# Altium schematic sheet Solenoids.SchDoc: Solenoids & Pressure Transducers
size Legal; DocumentNumber: 8; SheetNumber: 8; SheetTotal: 8; Project: Olympus
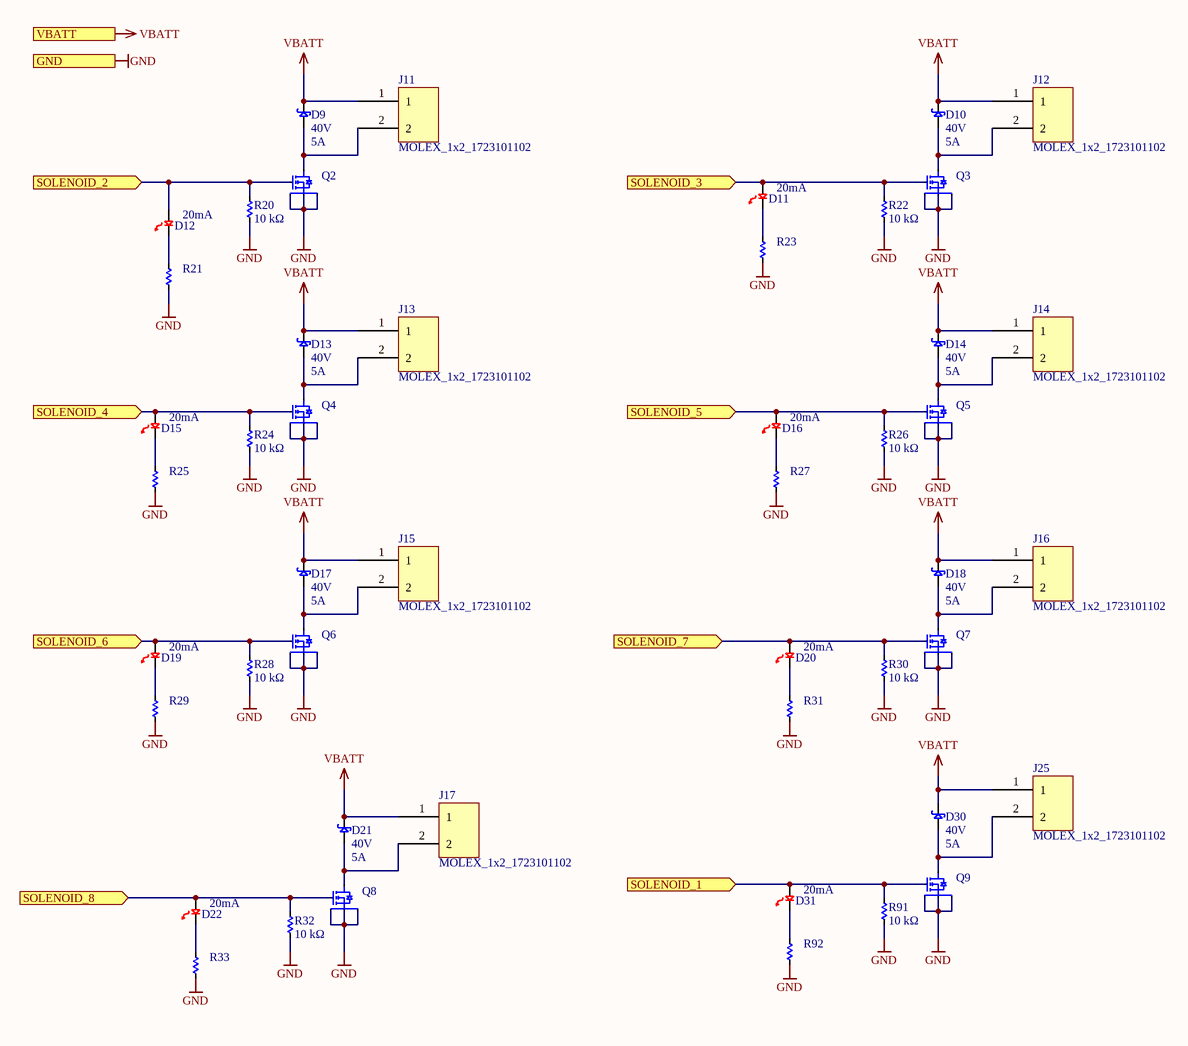
[diagram p0: Solenoids.SchDoc]

## Parts
D9  Voltage - DC Reverse (Vr) (Max): 40V  Current - Average Rectified (Io): 5A  [SMC]  (hidden comment: SCHOTTKY_B540C-13-F)
D10  Voltage - DC Reverse (Vr) (Max): 40V  Current - Average Rectified (Io): 5A  [SMC]  (hidden comment: SCHOTTKY_B540C-13-F)
D11  Current - Test: 20mA  [0805_Diode]  (hidden comment: LED_LY974)
D12  Current - Test: 20mA  [0805_Diode]  (hidden comment: LED_LY974)
D13  Voltage - DC Reverse (Vr) (Max): 40V  Current - Average Rectified (Io): 5A  [SMC]  (hidden comment: SCHOTTKY_B540C-13-F)
D14  Voltage - DC Reverse (Vr) (Max): 40V  Current - Average Rectified (Io): 5A  [SMC]  (hidden comment: SCHOTTKY_B540C-13-F)
D15  Current - Test: 20mA  [0805_Diode]  (hidden comment: LED_LY974)
D16  Current - Test: 20mA  [0805_Diode]  (hidden comment: LED_LY974)
D17  Voltage - DC Reverse (Vr) (Max): 40V  Current - Average Rectified (Io): 5A  [SMC]  (hidden comment: SCHOTTKY_B540C-13-F)
D18  Voltage - DC Reverse (Vr) (Max): 40V  Current - Average Rectified (Io): 5A  [SMC]  (hidden comment: SCHOTTKY_B540C-13-F)
D19  Current - Test: 20mA  [0805_Diode]  (hidden comment: LED_LY974)
D20  Current - Test: 20mA  [0805_Diode]  (hidden comment: LED_LY974)
D21  Voltage - DC Reverse (Vr) (Max): 40V  Current - Average Rectified (Io): 5A  [SMC]  (hidden comment: SCHOTTKY_B540C-13-F)
D22  Current - Test: 20mA  [0805_Diode]  (hidden comment: LED_LY974)
D30  Voltage - DC Reverse (Vr) (Max): 40V  Current - Average Rectified (Io): 5A  [SMC]  (hidden comment: SCHOTTKY_B540C-13-F)
D31  Current - Test: 20mA  [0805_Diode]  (hidden comment: LED_LY974)
J11  MOLEX_1x2_1723101102  [MOLEX_1x2_1723101102]
J12  MOLEX_1x2_1723101102  [MOLEX_1x2_1723101102]
J13  MOLEX_1x2_1723101102  [MOLEX_1x2_1723101102]
J14  MOLEX_1x2_1723101102  [MOLEX_1x2_1723101102]
J15  MOLEX_1x2_1723101102  [MOLEX_1x2_1723101102]
J16  MOLEX_1x2_1723101102  [MOLEX_1x2_1723101102]
J17  MOLEX_1x2_1723101102  [MOLEX_1x2_1723101102]
J25  MOLEX_1x2_1723101102  [MOLEX_1x2_1723101102]
Q2  NFET_CSD16323Q3  [8-VSON]  (value not drawn)
Q3  NFET_CSD16323Q3  [8-VSON]  (value not drawn)
Q4  NFET_CSD16323Q3  [8-VSON]  (value not drawn)
Q5  NFET_CSD16323Q3  [8-VSON]  (value not drawn)
Q6  NFET_CSD16323Q3  [8-VSON]  (value not drawn)
Q7  NFET_CSD16323Q3  [8-VSON]  (value not drawn)
Q8  NFET_CSD16323Q3  [8-VSON]  (value not drawn)
Q9  NFET_CSD16323Q3  [8-VSON]  (value not drawn)
R20  Resistance: 10 kΩ  [R0603]  (hidden comment: 311-10.0KHRCT-ND)
R21  311-1.00KHRCT-ND  [R0603]  (value not drawn)
R22  Resistance: 10 kΩ  [R0603]  (hidden comment: 311-10.0KHRCT-ND)
R23  311-1.00KHRCT-ND  [R0603]  (value not drawn)
R24  Resistance: 10 kΩ  [R0603]  (hidden comment: 311-10.0KHRCT-ND)
R25  311-1.00KHRCT-ND  [R0603]  (value not drawn)
R26  Resistance: 10 kΩ  [R0603]  (hidden comment: 311-10.0KHRCT-ND)
R27  311-1.00KHRCT-ND  [R0603]  (value not drawn)
R28  Resistance: 10 kΩ  [R0603]  (hidden comment: 311-10.0KHRCT-ND)
R29  311-1.00KHRCT-ND  [R0603]  (value not drawn)
R30  Resistance: 10 kΩ  [R0603]  (hidden comment: 311-10.0KHRCT-ND)
R31  311-1.00KHRCT-ND  [R0603]  (value not drawn)
R32  Resistance: 10 kΩ  [R0603]  (hidden comment: 311-10.0KHRCT-ND)
R33  311-1.00KHRCT-ND  [R0603]  (value not drawn)
R91  Resistance: 10 kΩ  [R0603]  (hidden comment: 311-10.0KHRCT-ND)
R92  311-1.00KHRCT-ND  [R0603]  (value not drawn)

## Ports
GND (in), SOLENOID_1 (in), SOLENOID_2 (in), SOLENOID_3 (in), SOLENOID_4 (in), SOLENOID_5 (in), SOLENOID_6 (in), SOLENOID_7 (in), SOLENOID_8 (in), VBATT (in)

## Nets
GND: Q2.1(S) Q2.2(S) Q2.3(S) Q3.1(S) Q3.2(S) Q3.3(S) Q4.1(S) Q4.2(S) Q4.3(S) Q5.1(S) Q5.2(S) Q5.3(S) Q6.1(S) Q6.2(S) Q6.3(S) Q7.1(S) Q7.2(S) Q7.3(S) Q8.1(S) Q8.2(S) Q8.3(S) Q9.1(S) Q9.2(S) Q9.3(S) R20.1 R21.1 R22.1 R23.1 R24.1 R25.1 R26.1 R27.1 R28.1 R29.1 R30.1 R31.1 R32.1 R33.1 R91.1 R92.1 ; port GND
VBATT: D9.2 D10.2 D13.2 D14.2 D17.2 D18.2 D21.2 D30.2 J11.1 J12.1 J13.1 J14.1 J15.1 J16.1 J17.1 J25.1 ; port VBATT
SOLENOID_1: D31.2 Q9.4(G) R91.2 ; port SOLENOID_1
SOLENOID_2: D12.2 Q2.4(G) R20.2 ; port SOLENOID_2
SOLENOID_3: D11.2 Q3.4(G) R22.2 ; port SOLENOID_3
SOLENOID_4: D15.2 Q4.4(G) R24.2 ; port SOLENOID_4
SOLENOID_5: D16.2 Q5.4(G) R26.2 ; port SOLENOID_5
SOLENOID_6: D19.2 Q6.4(G) R28.2 ; port SOLENOID_6
SOLENOID_7: D20.2 Q7.4(G) R30.2 ; port SOLENOID_7
SOLENOID_8: D22.2 Q8.4(G) R32.2 ; port SOLENOID_8
NetD9_1: D9.1 J11.2 Q2.5(D)
NetD10_1: D10.1 J12.2 Q3.5(D)
NetD11_1: D11.1 R23.2
NetD12_1: D12.1 R21.2
NetD13_1: D13.1 J13.2 Q4.5(D)
NetD14_1: D14.1 J14.2 Q5.5(D)
NetD15_1: D15.1 R25.2
NetD16_1: D16.1 R27.2
NetD17_1: D17.1 J15.2 Q6.5(D)
NetD18_1: D18.1 J16.2 Q7.5(D)
NetD19_1: D19.1 R29.2
NetD20_1: D20.1 R31.2
NetD21_1: D21.1 J17.2 Q8.5(D)
NetD22_1: D22.1 R33.2
NetD30_1: D30.1 J25.2 Q9.5(D)
NetD31_1: D31.1 R92.2

## Notes on the sheet
- PROJECT
- SHEET
- Powered By
- Sheet
- of
- REVISION
- ssi.stanford.edu
- ENGINEER
- REVIEWER
- REVIEWED ON

## Library data of the parts
D9 D10 D13 D14 D17 D18 D21 D30 = CMP-033-0054-1: DIODE SCHOTTKY 40V 5A SMC; Manufacturer: Diodes Inc; Voltage - Forward (Vf) (Max) @ If: 550mV @ 5A; Speed: Fast Recovery =< 500ns, > 200mA (Io); Current - Reverse Leakage @ Vr: 500µA @ 40V; Capacitance @ Vr, F: 300pF @ 4V, 1MHz; RoHS: RoHS Compliant; Stock 1: 22018; Pricing 1: 1=1.06, 10=0.912, 100=0.72, 250=0.624, 500=0.528, 1000=0.42 (USD); Diode Type: Schottky; Reverse Recovery Time (trr): -; Mounting Type: Surface Mount; Package / Case: DO-214AB, SMC; Supplier Device Package: SMC; Packaging: Cut Tape (CT); Datasheet: http://www.diodes.com/datasheets/ds13012.pdf; Manufacturer Part Number: B540C-13-F; Design Item ID: SCHOTTKY_B540C-13-F; Source: diode.SchLib
D11 D12 D15 D16 D19 D20 D22 D31 = CMP-033-0001-1: LED 0805 RED 20MA; Manufacturer: OSRAM Opto Semiconductors Inc; Manufacturer Part Number: LH R974-LP-1; Viewing Angle: 160°; Lens Transparency: Diffused; Millicandela Rating: 41mcd; Lens Style/Size: Rectangle with Flat Top, 1.30mm x 1.25mm; Wavelength - Peak: 660nm; Wavelength - Dominant: 645nm; Voltage - Forward (Vf) (Typ): 1.8V; Lens Color: White; Stock 1: 66379; Pricing 1: 1=0.08, 10=0.07, 100=0.0559, 250=0.04892, 500=0.04472 (USD); Packaging: Cut Tape (CT); ComponentLink1URL: http://www.osram-os.com/Graphics/XPic8/00078869_0.pdf; ComponentLink1Description: http://www.osram-os.com/Graphics/XPic8/00078869_0.pdf; Design Item ID: LED_LY974; Source: diode.SchLib; Mounting Type: Surface Mount; Size / Dimension: 2.00mm L x 1.25mm W; Package / Case: 0805 (2012 Metric); RoHS: RoHS Compliant; Color: Red; Supplier Device Package: *; Height (Max): 0.80mm
J11-J17 J25 = CMP-030-0038-1: ULTRAFIT CONN HEADER R/A 2POS 3.5MM; Source: connector.SchLib; Design Item ID: MOLEX_1x2_1723101102
Q2-Q8 = CMP-078-0020-1: MOSFET N-CH 25V 3.3X3.3 8-SON; Manufacturer: Texas Instruments; FET Type: MOSFET N-Channel, Metal Oxide; FET Feature: Logic Level Gate; Current - Continuous Drain (Id) @ 25°C: 21A (Ta), 60A (Tc); Rds On (Max) @ Id, Vgs: 4.5 mOhm @ 24A, 8V; Vgs(th) (Max) @ Id: 1.4V @ 250µA; Gate Charge (Qg) @ Vgs: 8.4nC @ 4.5V; Input Capacitance (Ciss) @ Vds: 1300pF @ 12.5V; Power - Max: 3W; Manufacturer Part Number: CSD16323Q3; RoHS: RoHS Compliant By Exemption; Stock 1: 23688; Pricing 1: 1=1.19, 10=1.061, 100=0.8271, 500=0.68404, 1000=0.43625 (USD); Packaging: Cut Tape (CT); Drain to Source Voltage (Vdss): 25V; Operating Temperature: -55°C ~ 150°C (TJ); Mounting Type: Surface Mount; Package / Case: 8-PowerTDFN; Supplier Device Package: 8-VSON (3.3x3.3); ComponentLink1URL: http://www.ti.com/lit/ds/symlink/csd16323q3.pdf; ComponentLink1Description: http://www.ti.com/lit/ds/symlink/csd16323q3.pdf; Design Item ID: NFET_CSD16323Q3; Source: transistor_fet.SchLib
Q9 = CMP-078-0020-1: MOSFET N-CH 25V 3.3X3.3 8-SON; Manufacturer: Texas Instruments; Vgs(th) (Max) @ Id: 1.4V @ 250µA; Gate Charge (Qg) @ Vgs: 8.4nC @ 4.5V; FET Type: MOSFET N-Channel, Metal Oxide; Current - Continuous Drain (Id) @ 25°C: 21A (Ta), 60A (Tc); FET Feature: Logic Level Gate; Input Capacitance (Ciss) @ Vds: 1300pF @ 12.5V; Rds On (Max) @ Id, Vgs: 4.5 mOhm @ 24A, 8V; Power - Max: 3W; Supplier Device Package: 8-VSON (3.3x3.3); Mounting Type: Surface Mount; Packaging: Cut Tape (CT); RoHS: RoHS Compliant By Exemption; Pricing 1: 1=1.19, 10=1.061, 100=0.8271, 500=0.68404, 1000=0.43625 (USD); Manufacturer Part Number: CSD16323Q3; Stock 1: 23688; Drain to Source Voltage (Vdss): 25V; Operating Temperature: -55°C ~ 150°C (TJ); ComponentLink1URL: http://www.ti.com/lit/ds/symlink/csd16323q3.pdf; Design Item ID: NFET_CSD16323Q3; Package / Case: 8-PowerTDFN; Source: transistor_fet.SchLib; ComponentLink1Description: http://www.ti.com/lit/ds/symlink/csd16323q3.pdf
R20 R22 R24 R26 R28 R30 R32 R91 = CMP-126-0273-1: RES SMD 10K OHM 1% 1/10W 0603; Manufacturer Part Number: RC0603FR-0710KL; Manufacturer: Yageo; Resistance (Sortable): 10000; Power (Watts): 0.1W, 1/10W; Temperature Coefficient: ±100ppm/°C; Datasheets: http://www.yageo.com/documents/recent/PYu-RC_Group_51_RoHS_L_9.pdf; Image: //media.digikey.com/Renders/Yageo%20Renders/0603-(1608-Metric).jpg; Tolerance: ±1%; Operating Temperature: -55°C ~ 155°C
R21 R23 R25 R27 R29 R31 R33 R92 = CMP-126-0172-1: RES SMD 1K OHM 1% 1/10W 0603; Manufacturer: Yageo; Manufacturer Part Number: RC0603FR-071KL; Power (Watts): 0.1W, 1/10W; Resistance (Sortable): 1000; Resistance: 1 kΩ; Temperature Coefficient: ±100ppm/°C; Image: //media.digikey.com/Renders/Yageo%20Renders/0603-(1608-Metric).jpg; Operating Temperature: -55°C ~ 155°C; Tolerance: ±1%; Datasheets: http://www.yageo.com/documents/recent/PYu-RC_Group_51_RoHS_L_9.pdf